# Altium schematic sheet 电机驱动.SchDoc
size A3
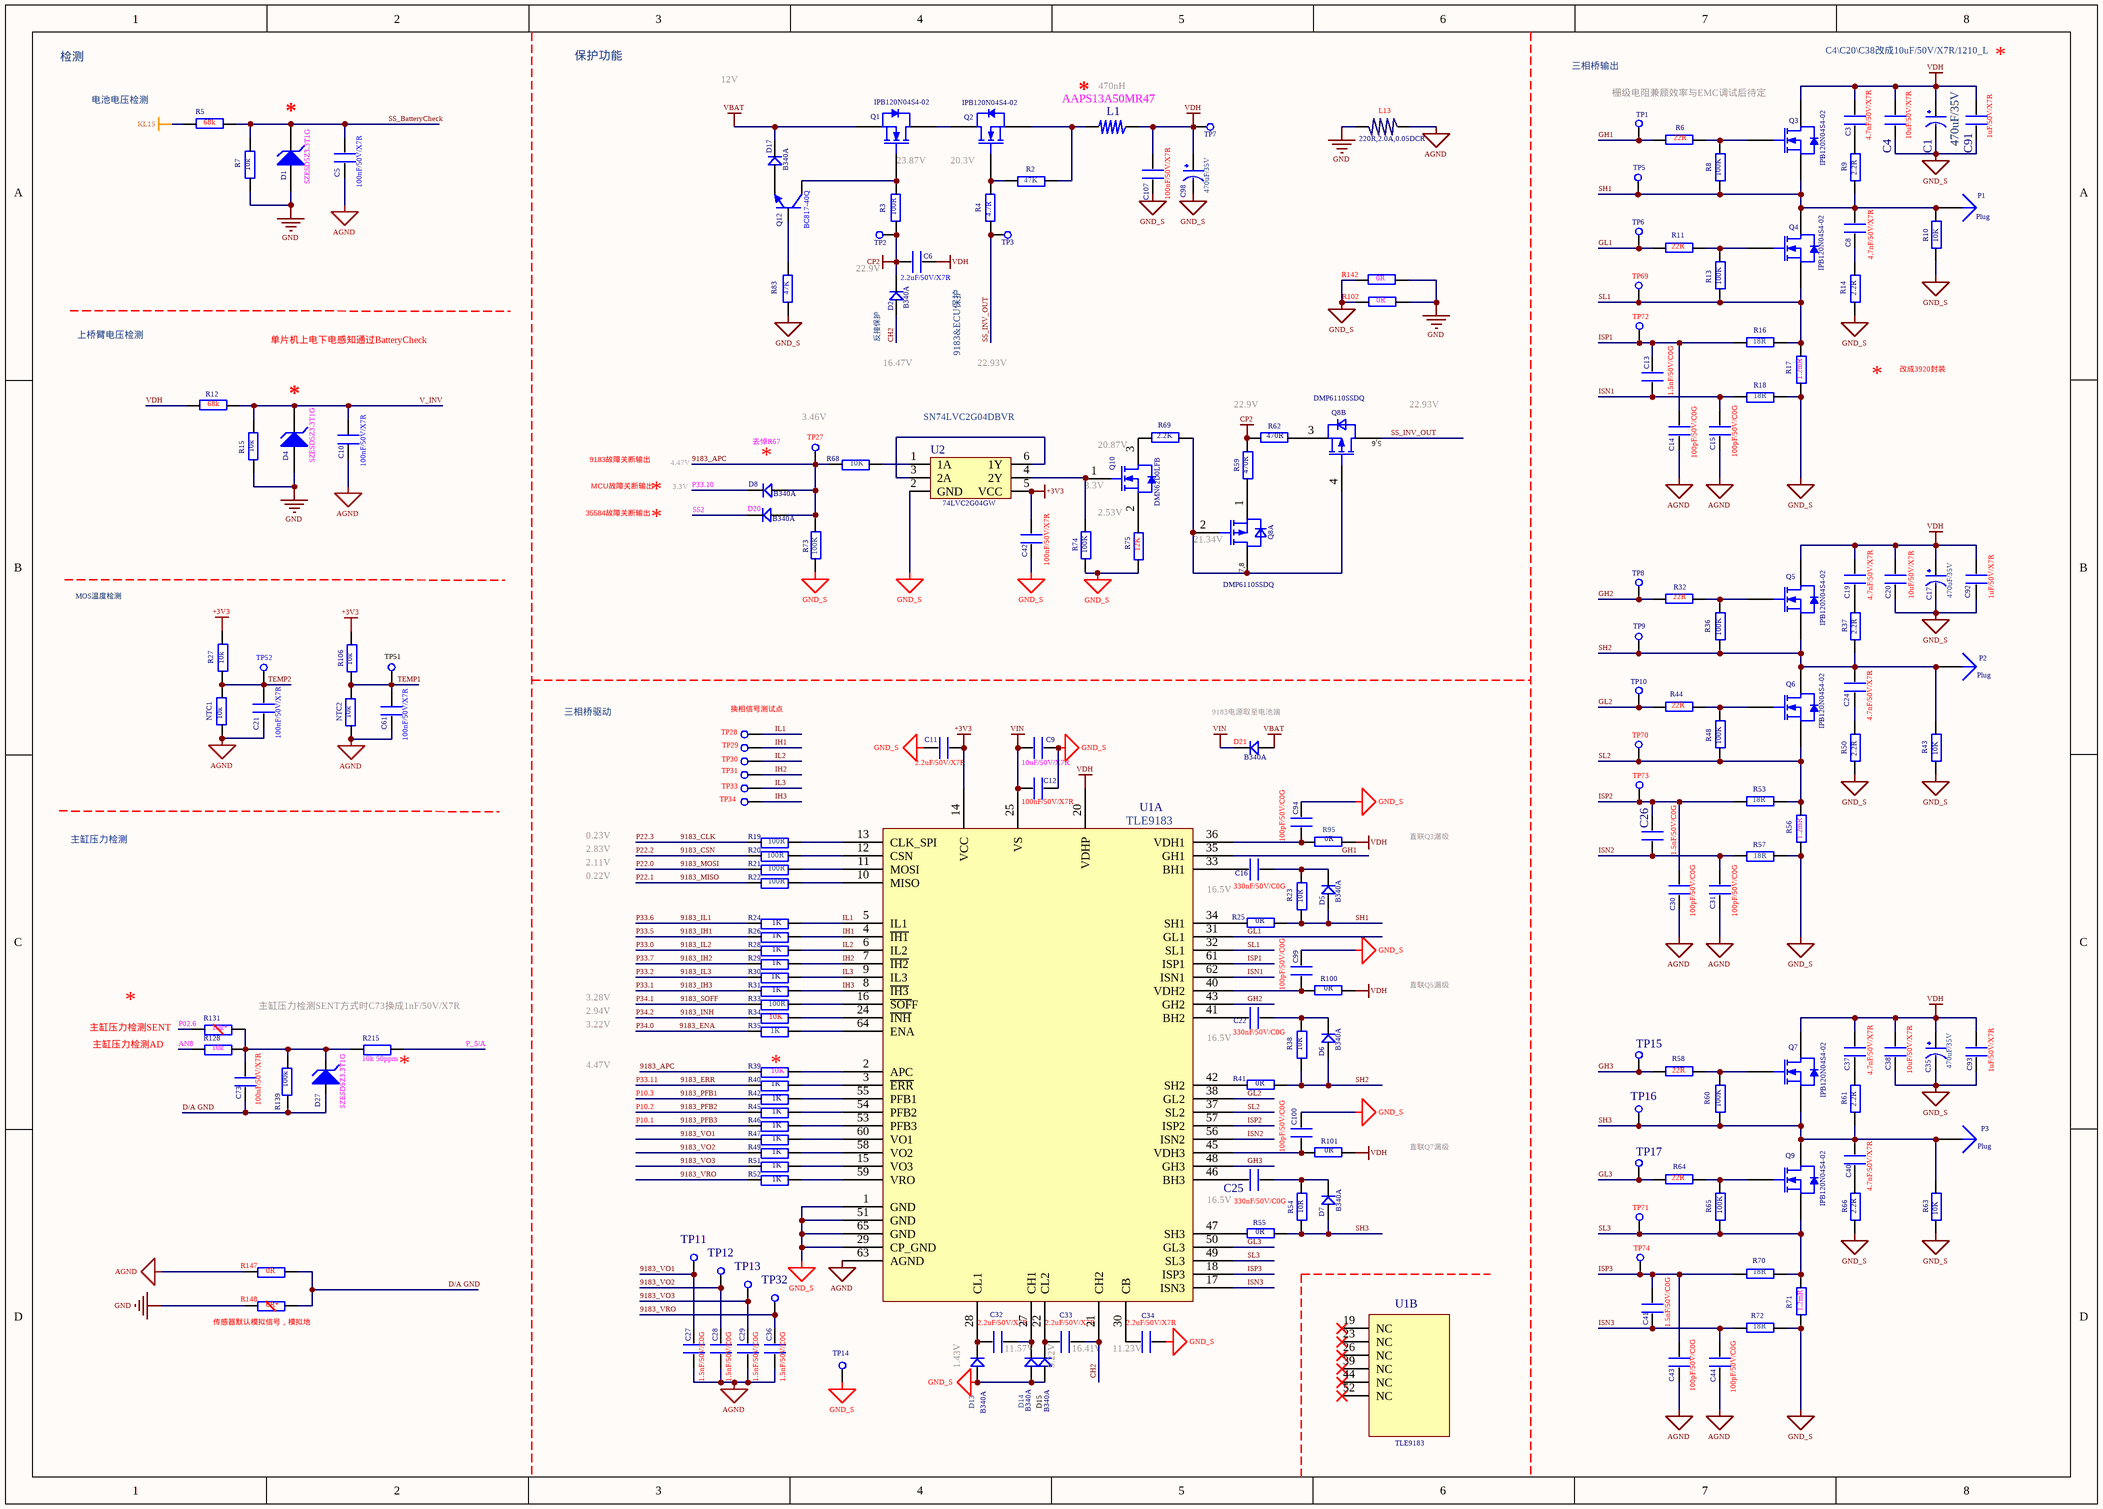
[diagram p0: 电机驱动.SchDoc]

## Parts
C1  470uF/35V  [CM F(10*10.2)]
C3  4.7nF/50V/X7R  [C0603P]
C4  10uF/50V/X7R  [C1210_L]
C5  100nF/50V/X7R  [C0603P]
C6  2.2uF/50V/X7R  [C0805]
C8  4.7nF/50V/X7R  [C0603P]
C9  10uF/50V/X7R  [C1206]
C10  100nF/50V/X7R  [C0603P]
C11  2.2uF/50V/X7R  [C0805]
C12  100nF/50V/X7R  [C0603P]
C13  1.5nF/50V/C0G  [C0603P]
C14  100pF/50V/C0G  [C0603P]
C15  100pF/50V/C0G  [C0603P]
C16  330nF/50V/C0G  [C0603P]
C17  470uF/35V  [CM F(10*10.2)]
C19  4.7nF/50V/X7R  [C0603P]
C20  10uF/50V/X7R  [C1210_L]
C21  100nF/50V/X7R  [C0603P]
C22  330nF/50V/C0G  [C0603P]
C24  4.7nF/50V/X7R  [C0603P]
C25  330nF/50V/C0G  [C0603P]
C26  1.5nF/50V/C0G  [C0603P]
C27  1.5nF/50V/C0G  [C0603P]
C28  1.5nF/50V/C0G  [C0603P]
C29  1.5nF/50V/C0G  [C0603P]
C30  100pF/50V/C0G  [C0603P]
C31  100pF/50V/C0G  [C0603P]
C32  2.2uF/50V/X7R  [C0805]
C33  2.2uF/50V/X7R  [C0805]
C34  2.2uF/50V/X7R  [C0805]
C35  470uF/35V  [CM F(10*10.2)]
C36  1.5nF/50V/C0G  [C0603P]
C37  4.7nF/50V/X7R  [C0603P]
C38  10uF/50V/X7R  [C1210_L]
C40  4.7nF/50V/X7R  [C0603P]
C41  1.5nF/50V/C0G  [C0603P]
C42  100nF/50V/X7R  [C0603P]
C43  100pF/50V/C0G  [C0603P]
C44  100pF/50V/C0G  [C0603P]
C61  100nF/50V/X7R  [C0603P]
C73  100nF/50V/X7R  [C0603P]
C91  1uF/50V/X7R  [C0805]
C92  1uF/50V/X7R  [C0805]
C93  1uF/50V/X7R  [C0805]
C94  100pF/50V/C0G  [C0603P]
C98  470uF/35V  [CM F(10*10.2)]
C99  100pF/50V/C0G  [C0603P]
C100  100pF/50V/C0G  [C0603P]
C107  100nF/50V/X7R  [0805]
D1  SZESD5Z3.3T1G  [SOD-523F]
D2  B340A  [DO-214AC]
D4  SZESD5Z3.3T1G  [SOD-523F]
D5  B340A  [DO-214AC]
D6  B340A  [DO-214AC]
D7  B340A  [DO-214AC]
D8  B340A  [DO-214AC]
D13  B340A  [DO-214AC]
D14  B340A  [DO-214AC]
D15  B340A  [DO-214AC]
D17  B340A  [DO-214AC]
D20  B340A  [DO-214AC]
D21  B340A  [DO-214AC]
D27  SZESD5Z3.3T1G  [SOD-523F]
L1  AAPS13A50MR47  [AAPS13A50MR47]
L13  220R,2.0A,0.05DCR  [0603P]
NTC1  10k  [0603P]
NTC2  10k  [0603P]
P1  Plug  [PNX - V1.41]
P2  Plug  [PNX - V1.41]
P3  Plug  [PNX - V1.41]
Q1  IPB120N04S4-02  [TOLL-8_L10.4-W9.9-P1.20-LS11.7-BL]
Q2  IPB120N04S4-02  [TOLL-8_L10.4-W9.9-P1.20-LS11.7-BL]
Q3  IPB120N04S4-02  [TOLL-8_L10.4-W9.9-P1.20-LS11.7-BL]
Q4  IPB120N04S4-02  [TOLL-8_L10.4-W9.9-P1.20-LS11.7-BL]
Q5  IPB120N04S4-02  [TOLL-8_L10.4-W9.9-P1.20-LS11.7-BL]
Q6  IPB120N04S4-02  [TOLL-8_L10.4-W9.9-P1.20-LS11.7-BL]
Q7  IPB120N04S4-02  [TOLL-8_L10.4-W9.9-P1.20-LS11.7-BL]
Q8  DMP6110SSDQ  [SOP-8_L4.9-W3.9-P1.27-LS6.0-BL]  (parts A,B of 2)
Q9  IPB120N04S4-02  [TOLL-8_L10.4-W9.9-P1.20-LS11.7-BL]
Q10  DMN62D0LFB  [X1-DFN1006-3_L1.0-W0.6-P0.35-BR]
Q12  BC817-40Q  [SOT-23N]
R2  47K  [0603P]
R3  100R  [1206]
R4  4.7R  [0603P]
R5  68k  [0603P]
R6  22R  [0805]
R7  10k  [0603P]
R8  100K  [0603P]
R9  2.2R  [0603P]
R10  10K  [0805]
R11  22R  [0805]
R12  68k  [0603P]
R13  100K  [0603P]
R14  2.2R  [0603P]
R15  10k  [0603P]
R16  18R  [0603P]
R17  1.2mR  [3920]
R18  18R  [0603P]
R19  100R  [0603P]
R20  100R  [0603P]
R21  100R  [0603P]
R22  100R  [0603P]
R23  10R  [0603P]
R24  1K  [0603P]
R25  0R  [0603P]
R26  1K  [0603P]
R27  10k  [0603P]
R28  1K  [0603P]
R29  1K  [0603P]
R30  1K  [0603P]
R31  1K  [0603P]
R32  22R  [0805]
R33  100R  [0603P]
R34  10K  [0603P]
R35  1K  [0603P]
R36  100K  [0603P]
R37  2.2R  [0603P]
R38  10R  [0603P]
R39  10K  [0603P]
R40  1K  [0603P]
R41  0R  [0603P]
R42  1K  [0603P]
R43  10K  [0805]
R44  22R  [0805]
R45  1K  [0603P]
R46  1K  [0603P]
R47  1K  [0603P]
R48  100K  [0603P]
R49  1K  [0603P]
R50  2.2R  [0603P]
R51  1K  [0603P]
R52  1K  [0603P]
R53  18R  [0603P]
R54  10R  [0603P]
R55  0R  [0603P]
R56  1.2mR  [3920]
R57  18R  [0603P]
R58  22R  [0805]
R59  470R  [0603P]
R60  100K  [0603P]
R61  2.2R  [0603P]
R62  470R  [0603P]
R63  10K  [0805]
R64  22R  [0805]
R65  100K  [0603P]
R66  2.2R  [0603P]
R68  10K  [0603P]
R69  2.2K  [0603P]
R70  18R  [0603P]
R71  1.2mR  [3920]
R72  18R  [0603P]
R73  100K  [0603P]
R74  100K  [0603P]
R75  12K  [0603P]
R83  47K  [0603P]
R95  0R  [0603P]
R100  0R  [0603P]
R101  0R  [0603P]
R102  0R  [0603P]
R106  10k  [0603P]
R128  10k  [0603P]
R131  10k*  [0603P]
R139  100k  [0603P]
R142  0R  [0603P]
R147  0R  [0603P]
R148  0R*  [0603P]
R215  10k 50ppm  [0603P]
TP1  测试点  [测试点]  (value not drawn)
TP2  测试点  [测试点]  (value not drawn)
TP3  测试点  [测试点]  (value not drawn)
TP5  测试点  [测试点]  (value not drawn)
TP6  测试点  [测试点]  (value not drawn)
TP7  测试点  [测试点]  (value not drawn)
TP8  测试点  [测试点]  (value not drawn)
TP9  测试点  [测试点]  (value not drawn)
TP10  测试点  [测试点]  (value not drawn)
TP11  测试点  [测试点]  (value not drawn)
TP12  测试点  [测试点]  (value not drawn)
TP13  测试点  [测试点]  (value not drawn)
TP14  测试点  [测试点]  (value not drawn)
TP15  测试点  [测试点]  (value not drawn)
TP16  测试点  [测试点]  (value not drawn)
TP17  测试点  [测试点]  (value not drawn)
TP27  测试点  [测试点]  (value not drawn)
TP28  测试点  [测试点]  (value not drawn)
TP29  测试点  [测试点]  (value not drawn)
TP30  测试点  [测试点]  (value not drawn)
TP31  测试点  [测试点]  (value not drawn)
TP32  测试点  [测试点]  (value not drawn)
TP33  测试点  [测试点]  (value not drawn)
TP34  测试点  [测试点]  (value not drawn)
TP51  测试点  [测试点]  (value not drawn)
TP52  测试点  [测试点]  (value not drawn)
TP69  测试点  [测试点]  (value not drawn)
TP70  测试点  [测试点]  (value not drawn)
TP71  测试点  [测试点]  (value not drawn)
TP72  测试点  [测试点]  (value not drawn)
TP73  测试点  [测试点]  (value not drawn)
TP74  测试点  [测试点]  (value not drawn)
U1  TLE9183  [INF-PG-LQFP-64-17_N]  (parts A,B of 2)
U2  74LVC2G04GW  [SOT-26_L3.0-W1.6-P0.95-LS2.8-BL]

## Nets
+3V3: C11.2 C42.1 R27.2 R106.2 U1.14(VCC) U2.5(VCC)
AGND: C5.1 C10.1 C14.2 C15.2 C21.1 C27.2 C28.2 C29.2 C30.2 C31.2 C36.2 C43.2 C44.2 C61.1 L13.1 NTC1.2 NTC2.2 R147.1 U1.63(AGND)
CP2: C6.1 D2.2 R3.2 R59.2 R62.2 TP2.1
GND: D1.2(A) D4.2(A) L13.2 R7.2 R15.2 R102.1 R142.1 R148.1
GND_S: C1.2(GND) C4.2 C9.2 C11.1 C12.2 C17.2(GND) C20.2 C34.2 C35.2(GND) C38.2 C42.2 C91.2 C92.2 C93.2 C94.1 C98.2(GND) C99.1 C100.1 C107.1 D13.1 D14.1 D15.1 R10.1 R14.1 R17.1 R18.2 R43.1 R50.1 R56.1 R57.2 R63.1 R66.1 R71.1 R72.1 R73.1 R74.1 R75.1 R83.2 R102.2 R142.2 TP14.1 U1.1(GND) U1.29(CP_GND) U1.51(GND) U1.65(GND) U2.2(GND)
KL15: R5.2
VBAT: D17.2 D21.1 Q1.3(S)
VDH: C1.1(VCC) C3.1 C4.1 C6.2 C17.1(VCC) C19.1 C20.1 C35.1(VCC) C37.1 C38.1 C91.1 C92.1 C93.1 C98.1(VCC) C107.2 L1.1 Q3.2(D) Q5.2(D) Q7.2(D) R12.2 R95.1 R100.1 R101.1 TP7.1 U1.20(VDHP)
VIN: C9.1 C12.1 D21.2 U1.25(VS)
9183_APC: D8.1 D20.1 R39.1 R68.1 R73.2 TP27.1
9183_CLK: R19.1  [also labelled P22.3]
9183_CSN: R20.1  [also labelled P22.2]
9183_ENA: R35.1  [also labelled P34.0]
9183_ERR: R40.1  [also labelled P33.11]
9183_IH1: R26.1  [also labelled P33.5]
9183_IH2: R29.1  [also labelled P33.7]
9183_IH3: R31.1  [also labelled P33.1]
9183_IL1: R24.1  [also labelled P33.6]
9183_IL2: R28.1  [also labelled P33.0]
9183_IL3: R30.1  [also labelled P33.2]
9183_INH: R34.1  [also labelled P34.2]
9183_MISO: R22.1  [also labelled P22.1]
9183_MOSI: R21.1  [also labelled P22.0]
9183_PFB1: R42.1  [also labelled P10.3]
9183_PFB2: R45.1  [also labelled P10.2]
9183_PFB3: R46.1  [also labelled P10.1]
9183_SOFF: R33.1  [also labelled P34.1]
9183_VO1: C27.1 R47.1 TP11.1
9183_VO2: C28.1 R49.1 TP12.1
9183_VO3: C29.1 R51.1 TP13.1
9183_VRO: C36.1 R52.1 TP32.1
AN8: R128.1
CH2: C33.2 D2.1 U1.21(CH2)
D/A GND: C73.2 D27.2(A) R139.2 R147.2 R148.2
GH1: R6.2 TP1.1 U1.35(GH1)
GH2: R32.2 TP8.1 U1.43(GH2)
GH3: R58.2 TP15.1 U1.48(GH3)
GL1: R11.2 TP6.1 U1.31(GL1)
GL2: R44.2 TP10.1 U1.38(GL2)
GL3: R64.2 TP17.1 U1.50(GL3)
IH1: R26.2 TP29.1 U1.4(~{IH1})
IH2: R29.2 TP31.1 U1.7(~{IH2})
IH3: R31.2 TP34.1 U1.8(~{IH3})
IL1: R24.2 TP28.1 U1.5(IL1)
IL2: R28.2 TP30.1 U1.6(IL2)
IL3: R30.2 TP33.1 U1.9(IL3)
ISN1: C13.2 C15.1 R18.1 U1.62(ISN1)
ISN2: C26.2 C31.1 R57.1 U1.56(ISN2)
ISN3: C41.2 C44.1 R72.2 U1.17(ISN3)
ISP1: C13.1 C14.1 R16.2 TP72.1 U1.61(ISP1)
ISP2: C26.1 C30.1 R53.2 TP73.1 U1.57(ISP2)
ISP3: C41.1 C43.1 R70.2 TP74.1 U1.18(ISP3)
P02.6: R131.1
P33.10: D8.2
P_S/A: R215.2
SH1: C8.1 D5.1 P1.1 Q3.3(S) Q4.2(D) R8.1 R9.1 R10.2 R23.1 R25.1 TP5.1
SH2: C24.1 D6.1 P2.1 Q5.3(S) Q6.2(D) R36.1 R37.1 R38.1 R41.1 R43.2 TP9.1
SH3: C40.1 D7.1 P3.1 Q7.3(S) Q9.2(D) R54.1 R55.1 R60.1 R61.1 R63.2 TP16.1
SL1: Q4.3(S) R13.1 R16.1 R17.2 TP69.1 U1.32(SL1)
SL2: Q6.3(S) R48.1 R53.1 R56.2 TP70.1 U1.37(SL2)
SL3: Q9.3(S) R65.1 R70.1 R71.2 TP71.1 U1.49(SL3)
SS2: D20.2
SS_BatteryCheck: C5.2 D1.1(K) R5.1 R7.1
SS_INV_OUT: Q8.5(SOURCE) R4.2 TP3.1
TEMP1: C61.2 NTC2.1 R106.1 TP51.1
TEMP2: C21.2 NTC1.1 R27.1 TP52.1
V_INV: C10.2 D4.1(K) R12.1 R15.1
NetC3_2: C3.2 R9.2
NetC8_2: C8.2 R14.2
NetC16_1: C16.1 U1.33(BH1)
NetC16_2: C16.2 D5.2 R23.2
NetC19_2: C19.2 R37.2
NetC22_1: C22.1 U1.41(BH2)
NetC22_2: C22.2 D6.2 R38.2
NetC24_2: C24.2 R50.2
NetC25_1: C25.1 U1.46(BH3)
NetC25_2: C25.2 D7.2 R54.2
NetC32_1: C32.1 D14.2 U1.27(CH1)
NetC32_2: C32.2 D13.2 U1.28(CL1)
NetC33_1: C33.1 D15.2 U1.22(CL2)
NetC34_1: C34.1 U1.30(CB)
NetC37_2: C37.2 R61.2
NetC40_2: C40.2 R66.2
NetC73_1: C73.1 D27.1(K) R128.2 R131.2 R139.1 R215.1
NetC94_2: C94.2 R95.2 U1.36(VDH1)
NetC99_2: C99.2 R100.2 U1.40(VDH2)
NetC100_2: C100.2 R101.2 U1.45(VDH3)
NetD17_1: D17.1 Q12.3(E)
NetL1_2: L1.2 Q2.3(S) R2.2
NetQ1_1: Q1.1(G) Q12.2(C) R3.1
NetQ1_2: Q1.2(D) Q2.2(D)
NetQ2_1: Q2.1(G) R2.1 R4.1
NetQ3_1: Q3.1(G) R6.1 R8.2
NetQ4_1: Q4.1(G) R11.1 R13.2
NetQ5_1: Q5.1(G) R32.1 R36.2
NetQ6_1: Q6.1(G) R44.1 R48.2
NetQ7_1: Q7.1(G) R58.1 R60.2
NetQ8_1: Q8.1(DRAIN) R59.1
NetQ8_2: Q8.2(GATE) Q8.4(GATE) Q8.7(SOURCE) R69.1
NetQ8_3: Q8.3(DRAIN) R62.1
NetQ9_1: Q9.1(G) R64.1 R65.2
NetQ10_1: Q10.1(G) R74.2 U2.4(2Y)
NetQ10_2: Q10.2(S) R75.2
NetQ10_3: Q10.3(D) R69.2
NetQ12_1: Q12.1(B) R83.1
NetR19_2: R19.2 U1.13(CLK_SPI)
NetR20_2: R20.2 U1.12(CSN)
NetR21_2: R21.2 U1.11(MOSI)
NetR22_2: R22.2 U1.10(MISO)
NetR25_2: R25.2 U1.34(SH1)
NetR33_2: R33.2 U1.16(~{SOF}F)
NetR34_2: R34.2 U1.24(~{INH})
NetR35_2: R35.2 U1.64(ENA)
NetR39_2: R39.2 U1.2(APC)
NetR40_2: R40.2 U1.3(~{ERR})
NetR41_2: R41.2 U1.42(SH2)
NetR42_2: R42.2 U1.55(PFB1)
NetR45_2: R45.2 U1.54(PFB2)
NetR46_2: R46.2 U1.53(PFB3)
NetR47_2: R47.2 U1.60(VO1)
NetR49_2: R49.2 U1.58(VO2)
NetR51_2: R51.2 U1.15(VO3)
NetR52_2: R52.2 U1.59(VRO)
NetR55_2: R55.2 U1.47(SH3)
NetR68_2: R68.2 U2.1(1A)
NetU2_3: U2.3(2A) U2.6(1Y)

Not connected (* = marked no-connect by the designer): Q8 6(DRAIN) 8(DRAIN); U1 19(NC)* 23(NC)* 26(NC)* 39(NC)* 44(NC)* 52(NC)*

## Notes on the sheet
- 检测
- 电池电压检测
- 保护功能
- 12V
- (near L1) *
- (near L1) 470nH
- 三相桥输出
- 栅级电阻兼顾效率与EMC调试后待定
- C4\C20\C38改成10uF/50V/X7R/1210_L
- *
- (near Q1) 23.87V
- (near Q2) 20.3V
- 22.9V
- 上桥臂电压检测
- 单片机上电下电感知通过BatteryCheck
- (near D2) 反接保护
- 16.47V
- 9183&ECU保护
- 22.93V
- 改成3920封装
- (near D4) *
- 去悼R67
- 3.46V
- (near U2) SN74LVC2G04DBVR
- (near Q10) 20.87V
- (near Q8) 22.93V
- 35584故障关断输出
- 9183故障关断输出
- MCU故障关断输出
- 4.47V
- 3.3V
- (near D8) *
- (near Q10) 3.3V
- 2.53V
- (near Q8) 21.34V
- MOS温度检测
- 三相桥驱动
- 换相信号测试点
- (near D21) 9183电源取至电池端
- 主缸压力检测
- 0.23V
- 2.83V
- 直联Q3漏级
- 2.11V
- 0.22V
- 16.5V
- 直联Q5漏级
- 主缸压力检测SENT
- 主缸压力检测AD
- 主缸压力检测SENT方式时C73换成1nF/50V/X7R
- 3.28V
- 2.94V
- 3.22V
- (near R215) *
- (near R39) *
- 直联Q7漏级
- (near R148) 传感器默认模拟信号，模拟地
- (near D13) 1.43V
- 11.57V
- 5.22V
- (near C33) 16.41V
- (near C34) 11.23V
- Title
- Size:
- Date:
- A4
- Number:
- Time:
- Revision:
- Sheet
- of
- File:
- (in symbol DMP6110SSDQ, part A) 7,8
- (in symbol DMP6110SSDQ, part B) 5,6

## Library data of the parts
C1 C17 C35 C98 = CAP
C3-C6 C8-C16 C19-C22 C24-C34 C36-C38 C40-C44 C61 C73 C91-C94 C99 C100 C107 = C
D1 D4 D27 = D Zener: Zener Diode; Published: 8-Jun-2000; LatestRevisionDate: 17-Jul-2002; LatestRevisionNote: Re-released for DXP Platform.; PackageReference: DIODE-0.7; Publisher: Altium Limited; PackageDescription: Diode, Thru-Hole; 2 Leads; 0.7 in Pin Spacing
D2 D5-D8 D13-D15 D17 D20 D21 = D
L1 = L_SOP
L13 = L
NTC1 NTC2 R2-R66 R68-R75 R83 R95 R100-R102 R106 R128 R131 R139 R142 R147 R148 R215 = R
Q1-Q7 Q9 Q10 = IPB120N04S4
Q12 = M_NPN: 贴片三极管
U1 = TLE9180: PRO-SIL(TM) 3-Phase Bridge Driver IC, 5.5 to 28 V, 30 uA Iq, -40 to 150 degC, PG-LQFP-64-17, Reel, Green; Manufacturer: Infineon; PartNumber: TLE7189QK; Adjustable dead time: FALSE; Adjustable short circuit detection: TRUE; D.C. Range @ 20kHz: 0...100%; Diagnosis: UV, OV, SCD, OT, VDD supervision; Iq: 30 uA; Integrated OPAMPs for load current measurement: 3; Turn on/off Current: 1.5 / 1.5 A; DatasheetVersion: Rev. 2.0; PackageVersion: Rev. 2.0, 07/2009; PackageReference: PG-LQFP-64-17; PackageDescription: 64-Pin Plastic (Green) Low Profile Quad Flat Package, Body 10 x 10 mm, Pitch 0.5 mm; Supplier 1: Digi-Key; Supplier Part Number 1: TLE7189QK-ND; Supplier 2: Mouser; Supplier Part Number 2: 726-TLE7189QK; Green: TRUE; Halogen-free: TRUE; Operating Range: 5.5 to 28 V; Packing: Reel; Mounting Technology: Surface Mount; Code_JEDEC: J-STD-020; ComponentLink1Description: Manufacturer URL; ComponentLink1URL: http://www.infineon.com/; ComponentLink2Description: Datasheet; ComponentLink2URL: http://www.infineon.com/dgdl/TLE7189QK_DS20.pdf?folderId=db3a30431ddc9372011e26863f92474e&fileId=db3a30432239cccd0122c1ca7b54599f&location=en.Products.Automotive_ICs.Motor_Drivers__Automotive_.Gate_Driver_ICs_for_external_MOSFETs.3-Phase_Bridge_Driver_IC_.DATASHEET.TLE7189QK_DS20.pdf; ComponentLink3Description: Package Specification; ComponentLink3URL: http://www.infineon.com/dgdl/TLE7189QK_DS20.pdf?folderId=db3a30431ddc9372011e26863f92474e&fileId=db3a30432239cccd0122c1ca7b54599f&sId=db3a30443e0c87a1013e11f7e1350d52
P1-P3 = Plug: LatestRevisionDate: 17-Jul-2002; LatestRevisionNote: Re-released for DXP Platform.; Publisher: Altium Limited